# EAGLE design hd6303-exp-x1 (EAGLE 9.2.2)

## Sheet 1 of 2
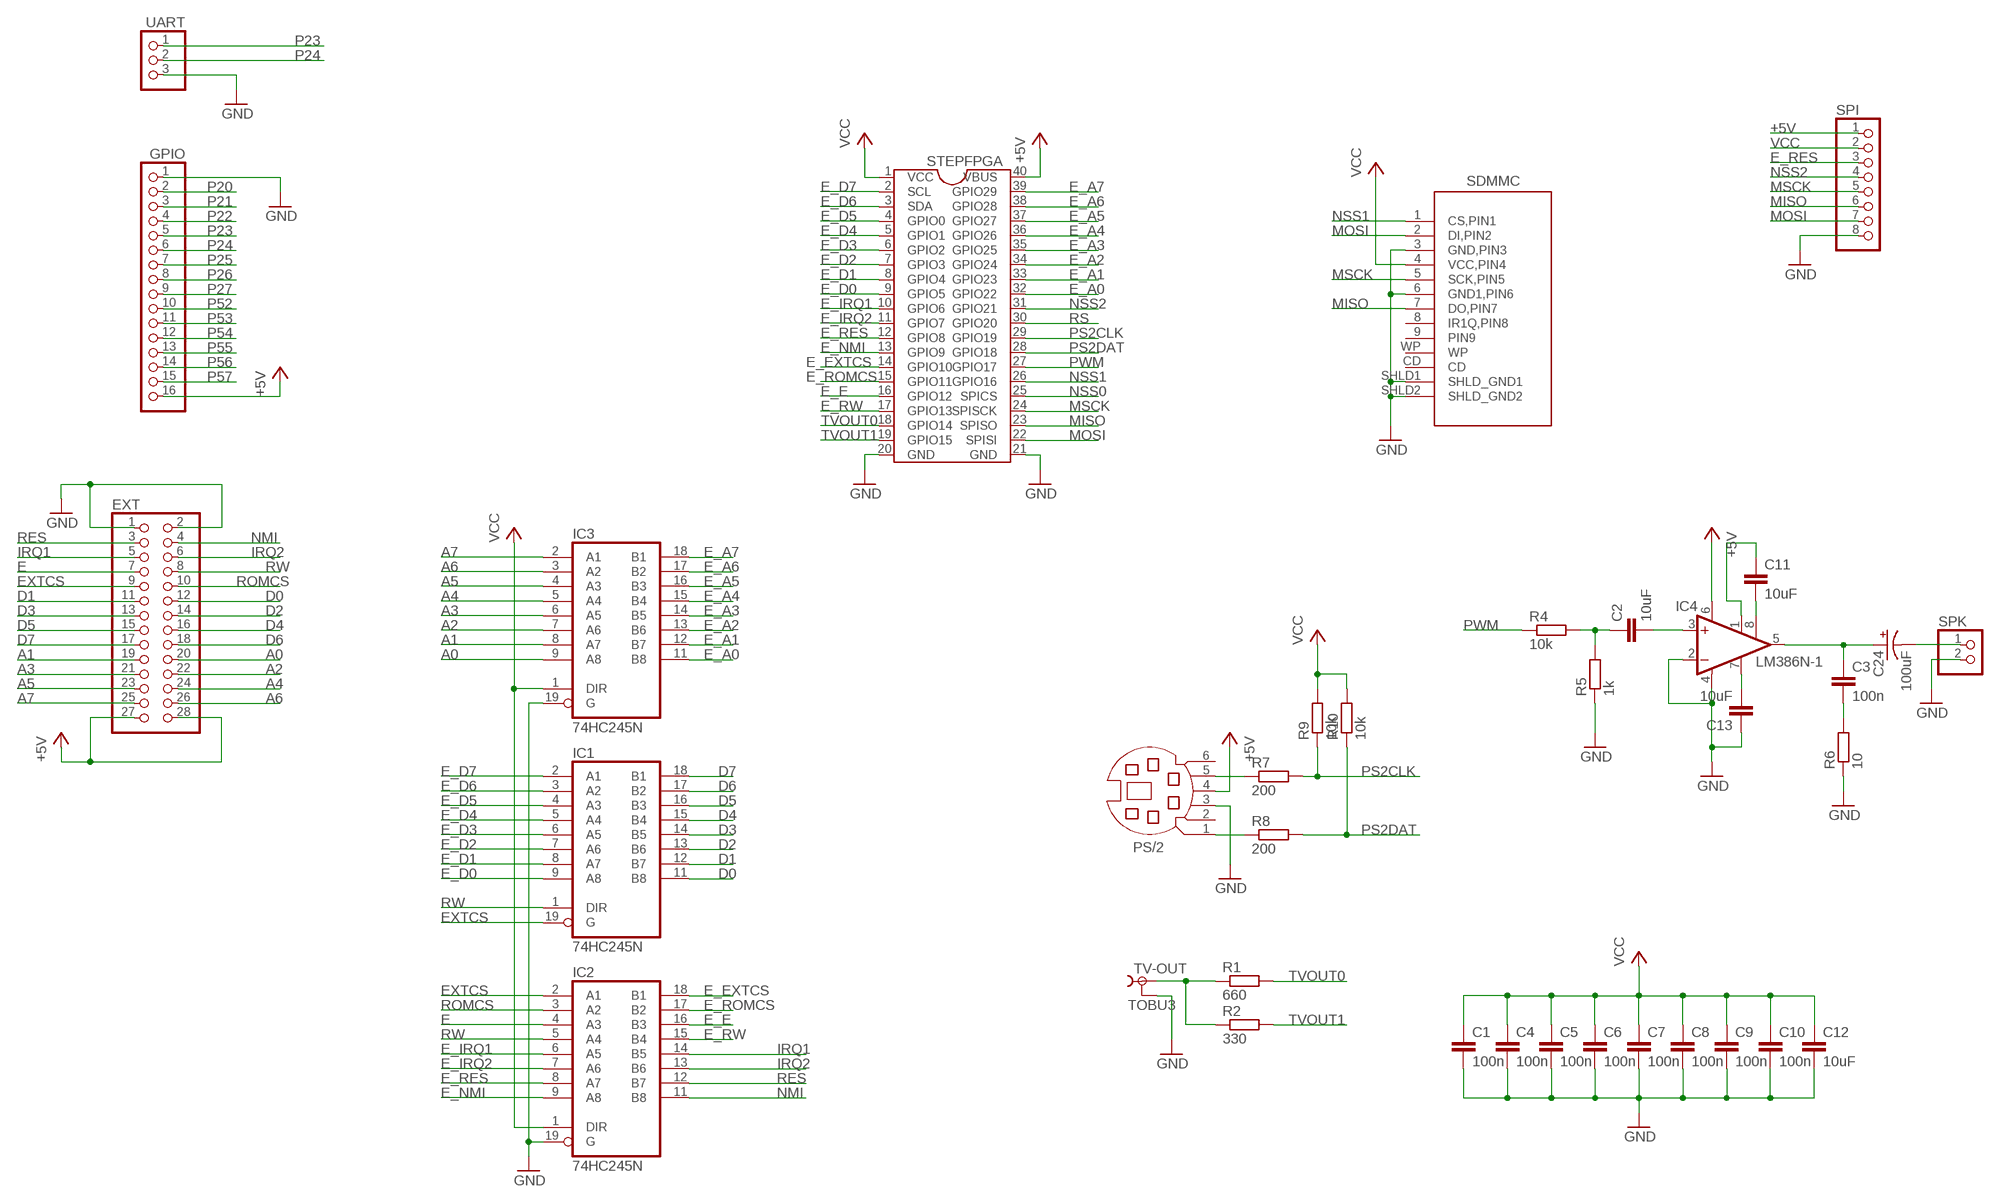
[diagram p0: schematic, sheet 1]

### Parts
C1  100n  C-EUC0603  [C0603]
C2  10uF  C-EUC0805  [C0805]
C3  100n  C-EUC0603  [C0603]
C4  100n  C-EUC0603  [C0603]
C5  100n  C-EUC0603  [C0603]
C6  100n  C-EUC0603  [C0603]
C7  100n  C-EUC0603  [C0603]
C8  100n  C-EUC0603  [C0603]
C9  100n  C-EUC0603  [C0603]
C10  100n  C-EUC0603  [C0603]
C11  10uF  C-EUC0805  [C0805]
C12  10uF  C-EUC0805  [C0805]
C13  10uF  C-EUC0805  [C0805]
C24  100uF  CAP_POL7343  [EIA7343]
EXT  PINHD-2X14  [2X14]
GPIO  PINHD-1X16  [1X16]
IC1  74HC245N  [DIL20]
IC2  74HC245N  [DIL20]
IC3  74HC245N  [DIL20]
IC4  LM386N-1  [DIL08]
PS/2  MD06SS  [MDIN06SS]
R1  660  R-EU_R0603  [R0603]
R2  330  R-EU_R0603  [R0603]
R4  10k  R-EU_R0603  [R0603]
R5  1k  R-EU_R0603  [R0603]
R6  10  R-EU_R0603  [R0603]
R7  200  R-EU_R0603  [R0603]
R8  200  R-EU_R0603  [R0603]
R9  10k  R-EU_R0603  [R0603]
R10  10k  R-EU_R0603  [R0603]
SDMMC  FCI_SD_SOCKET  [SD-MMC_SOCKET-PP]
SPI  PINHD-1X8  [1X08]
SPK  PINHD-1X2  [1X02]
STEPFPGA  STEPFPGA  [DIL40]
TV-OUT  TOBU3  [TOBU3]
UART  PINHD-1X3  [1X03]

### Nets
+5V: EXT.27 EXT.28 GPIO.16 IC4.6(VS) PS/2.4 SPI.1 STEPFPGA.40(VBUS)
A0: EXT.20 IC3.9(A8)
A1: EXT.19 IC3.8(A7)
A2: EXT.22 IC3.7(A6)
A3: EXT.21 IC3.6(A5)
A4: EXT.24 IC3.5(A4)
A5: EXT.23 IC3.4(A3)
A6: EXT.26 IC3.3(A2)
A7: EXT.25 IC3.2(A1)
D0: EXT.12 IC1.11(B8)
D1: EXT.11 IC1.12(B7)
D2: EXT.14 IC1.13(B6)
D3: EXT.13 IC1.14(B5)
D4: EXT.16 IC1.15(B4)
D5: EXT.15 IC1.16(B3)
D6: EXT.18 IC1.17(B2)
D7: EXT.17 IC1.18(B1)
E: EXT.7 IC2.4(A3)
E_A0: IC3.11(B8) STEPFPGA.32(GPIO22)
E_A1: IC3.12(B7) STEPFPGA.33(GPIO23)
E_A2: IC3.13(B6) STEPFPGA.34(GPIO24)
E_A3: IC3.14(B5) STEPFPGA.35(GPIO25)
E_A4: IC3.15(B4) STEPFPGA.36(GPIO26)
E_A5: IC3.16(B3) STEPFPGA.37(GPIO27)
E_A6: IC3.17(B2) STEPFPGA.38(GPIO28)
E_A7: IC3.18(B1) STEPFPGA.39(GPIO29)
E_D0: IC1.9(A8) STEPFPGA.9(GPIO5)
E_D1: IC1.8(A7) STEPFPGA.8(GPIO4)
E_D2: IC1.7(A6) STEPFPGA.7(GPIO3)
E_D3: IC1.6(A5) STEPFPGA.6(GPIO2)
E_D4: IC1.5(A4) STEPFPGA.5(GPIO1)
E_D5: IC1.4(A3) STEPFPGA.4(GPIO0)
E_D6: IC1.3(A2) STEPFPGA.3(SDA)
E_D7: IC1.2(A1) STEPFPGA.2(SCL)
E_E: IC2.16(B3) STEPFPGA.16(GPIO12)
E_EXTCS: IC2.18(B1) STEPFPGA.14(GPIO10)
E_IRQ1: IC2.6(A5) STEPFPGA.10(GPIO6)
E_IRQ2: IC2.7(A6) STEPFPGA.11(GPIO7)
E_NMI: IC2.9(A8) STEPFPGA.13(GPIO9)
E_RES: IC2.8(A7) SPI.3 STEPFPGA.12(GPIO8) ; also sheet 2
E_ROMCS: IC2.17(B2) STEPFPGA.15(GPIO11)
E_RW: IC2.15(B4) STEPFPGA.17(GPIO13)
EXTCS: EXT.9 IC1.19(G) IC2.2(A1)
GND: C1.2 C4.2 C5.2 C6.2 C7.2 C8.2 C9.2 C10.2 C12.2 C13.1 EXT.1 EXT.2 GPIO.1 IC2.19(G) IC3.19(G) IC4.2(-IN) IC4.4(GND) PS/2.3 R5.1 R6.1 SDMMC.3(GND,PIN3) SDMMC.6(GND1,PIN6) SDMMC.SHLD1(SHLD_GND1) SDMMC.SHLD2(SHLD_GND2) SPI.8 SPK.2 STEPFPGA.20(GND) STEPFPGA.21(GND) TV-OUT.2 TV-OUT.2@1 TV-OUT.2@2 UART.3 ; also sheet 2
IRQ1: EXT.5 IC2.14(B5)
IRQ2: EXT.6 IC2.13(B6)
MISO: SDMMC.7(DO,PIN7) SPI.6 STEPFPGA.23(SPISO)
MOSI: SDMMC.2(DI,PIN2) SPI.7 STEPFPGA.22(SPISI) ; also sheet 2
MSCK: SDMMC.5(SCK,PIN5) SPI.5 STEPFPGA.24(SPISCK) ; also sheet 2
N$4: C2.2 IC4.3(+IN)
N$5: C2.1 R4.2 R5.2
N$6: R1.1 R2.1 TV-OUT.1
N$7: C3.1 C24.A(+) IC4.5(OUT)
N$8: C3.2 R6.2
N$9: C11.1 IC4.1(GAIN)
N$10: C11.2 IC4.8(GAIN)
N$11: C24.C(-) SPK.1
N$12: C13.2 IC4.7(BYPASS)
N$23: PS/2.5 R7.1
N$24: PS/2.1 R8.1
NMI: EXT.4 IC2.11(B8)
NSS0: STEPFPGA.25(SPICS) ; also sheet 2
NSS1: SDMMC.1(CS,PIN1) STEPFPGA.26(GPIO16)
NSS2: SPI.4 STEPFPGA.31(GPIO21)
P20: GPIO.2
P21: GPIO.3
P22: GPIO.4
P23: GPIO.5 UART.1
P24: GPIO.6 UART.2
P25: GPIO.7
P26: GPIO.8
P27: GPIO.9
P52: GPIO.10
P53: GPIO.11
P54: GPIO.12
P55: GPIO.13
P56: GPIO.14
P57: GPIO.15
PS2CLK: R7.2 R9.1 STEPFPGA.29(GPIO19)
PS2DAT: R8.2 R10.1 STEPFPGA.28(GPIO18)
PWM: R4.1 STEPFPGA.27(GPIO17)
RES: EXT.3 IC2.12(B7)
ROMCS: EXT.10 IC2.3(A2)
RS: STEPFPGA.30(GPIO20) ; also sheet 2
RW: EXT.8 IC1.1(DIR) IC2.5(A4)
TVOUT0: R1.2 STEPFPGA.18(GPIO14)
TVOUT1: R2.2 STEPFPGA.19(GPIO15)
VCC: C1.1 C4.1 C5.1 C6.1 C7.1 C8.1 C9.1 C10.1 C12.1 IC2.1(DIR) IC3.1(DIR) R9.2 R10.2 SDMMC.4(VCC,PIN4) SPI.2 STEPFPGA.1(VCC) ; also sheet 2
Unconnected: PS/2.2 PS/2.6 SDMMC.8(IR1Q,PIN8) SDMMC.9(PIN9) SDMMC.CD SDMMC.WP

## Sheet 2 of 2
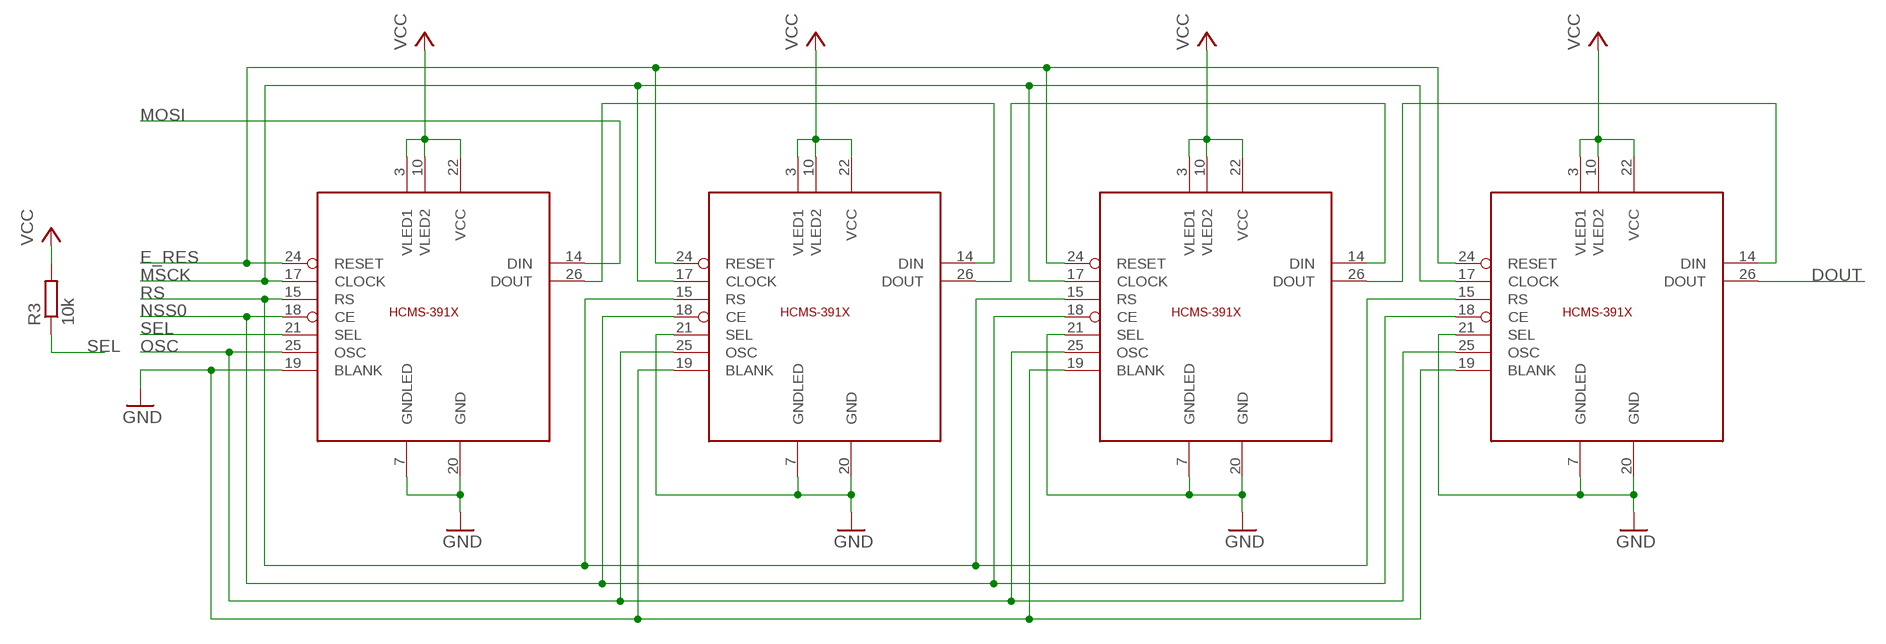
[diagram p1: schematic, sheet 2]

### Parts
R3  10k  R-EU_R0603  [R0603]
U$1  HCMS-391X  [HCMS-391X]
U$2  HCMS-391X  [HCMS-391X]
U$3  HCMS-391X  [HCMS-391X]
U$4  HCMS-391X  [HCMS-391X]

### Nets
DOUT: U$4.26(DOUT)
E_RES: U$1.24(RESET) U$2.24(RESET) U$3.24(RESET) U$4.24(RESET) ; also sheet 1
GND: U$1.7(GNDLED) U$1.19(BLANK) U$1.20(GND) U$2.7(GNDLED) U$2.19(BLANK) U$2.20(GND) U$2.21(SEL) U$3.7(GNDLED) U$3.19(BLANK) U$3.20(GND) U$3.21(SEL) U$4.7(GNDLED) U$4.19(BLANK) U$4.20(GND) U$4.21(SEL) ; also sheet 1
MOSI: U$1.14(DIN) ; also sheet 1
MSCK: U$1.17(CLOCK) U$2.17(CLOCK) U$3.17(CLOCK) U$4.17(CLOCK) ; also sheet 1
N$1: U$1.26(DOUT) U$2.14(DIN)
N$2: U$2.26(DOUT) U$3.14(DIN)
N$3: U$3.26(DOUT) U$4.14(DIN)
NSS0: U$1.18(CE) U$2.18(CE) U$3.18(CE) U$4.18(CE) ; also sheet 1
OSC: U$1.25(OSC) U$2.25(OSC) U$3.25(OSC) U$4.25(OSC)
RS: U$1.15(RS) U$2.15(RS) U$3.15(RS) U$4.15(RS) ; also sheet 1
SEL: R3.1 U$1.21(SEL)
VCC: R3.2 U$1.3(VLED1) U$1.10(VLED2) U$1.22(VCC) U$2.3(VLED1) U$2.10(VLED2) U$2.22(VCC) U$3.3(VLED1) U$3.10(VLED2) U$3.22(VCC) U$4.3(VLED1) U$4.10(VLED2) U$4.22(VCC) ; also sheet 1

## Power pins joined to a net without a drawn wire
GND: IC1.10(GND) IC2.10(GND) IC3.10(GND)
VCC: IC1.20(VCC) IC2.20(VCC) IC3.20(VCC)

## Library data of the parts
C1 C3-C10 = rcl:C-EU: CAPACITOR, European symbol
C2 C11-C13 = resistor:C-EU: CAPACITOR, European symbol
C24 = SparkFun:CAP_POL: Capacitor Polarized These are standard SMD and PTH capacitors. Normally 10uF, 47uF, and 100uF in electrolytic and tantalum varieties. Always verify the external diameter of the through hole cap, it varies with capacity, voltage, and manufacturer. The EIA devices should be standard.
EXT = pinhead:PINHD-2X14: PIN HEADER
GPIO = pinhead:PINHD-1X16: PIN HEADER
IC1-IC3 = 74xx-eu:74*245: Octal BUS TRANSCEIVER, 3-state
IC4 = linear:LM386?-*: Low Voltage Audio Power Amplifier Source: http://cache.national.com/ds/LM/LM386.pdf
PS/2 = con-yamaichi:MD06SS: YAMAICHI CONNECTOR; OC_FARNELL: unknown; OC_NEWARK: unknown
R1-R10 = resistor:R-EU_: RESISTOR, European symbol
SDMMC = stepfpga:FCI_SD_SOCKET: FCI Memory Card Connector (SD card); MF: FCI; MOUSER: 649-10067847-001RLF; MPN: 10067847-001RLF
SPI = pinhead:PINHD-1X8: PIN HEADER
SPK = pinhead:PINHD-1X2: PIN HEADER
STEPFPGA = stepfpga:STEPFPGA: StepFPGA module
TV-OUT = con-hirschmann:TOBU3: Female Cinch CONNECTOR ( RCA Jack ); MF: FARNELL; MPN: TOBU 3; OC_FARNELL: 592791; OC_NEWARK: 06WX5914
U$1-U$4 = HCMS-391X:HCMS-391X
UART = pinhead:PINHD-1X3: PIN HEADER

## Board
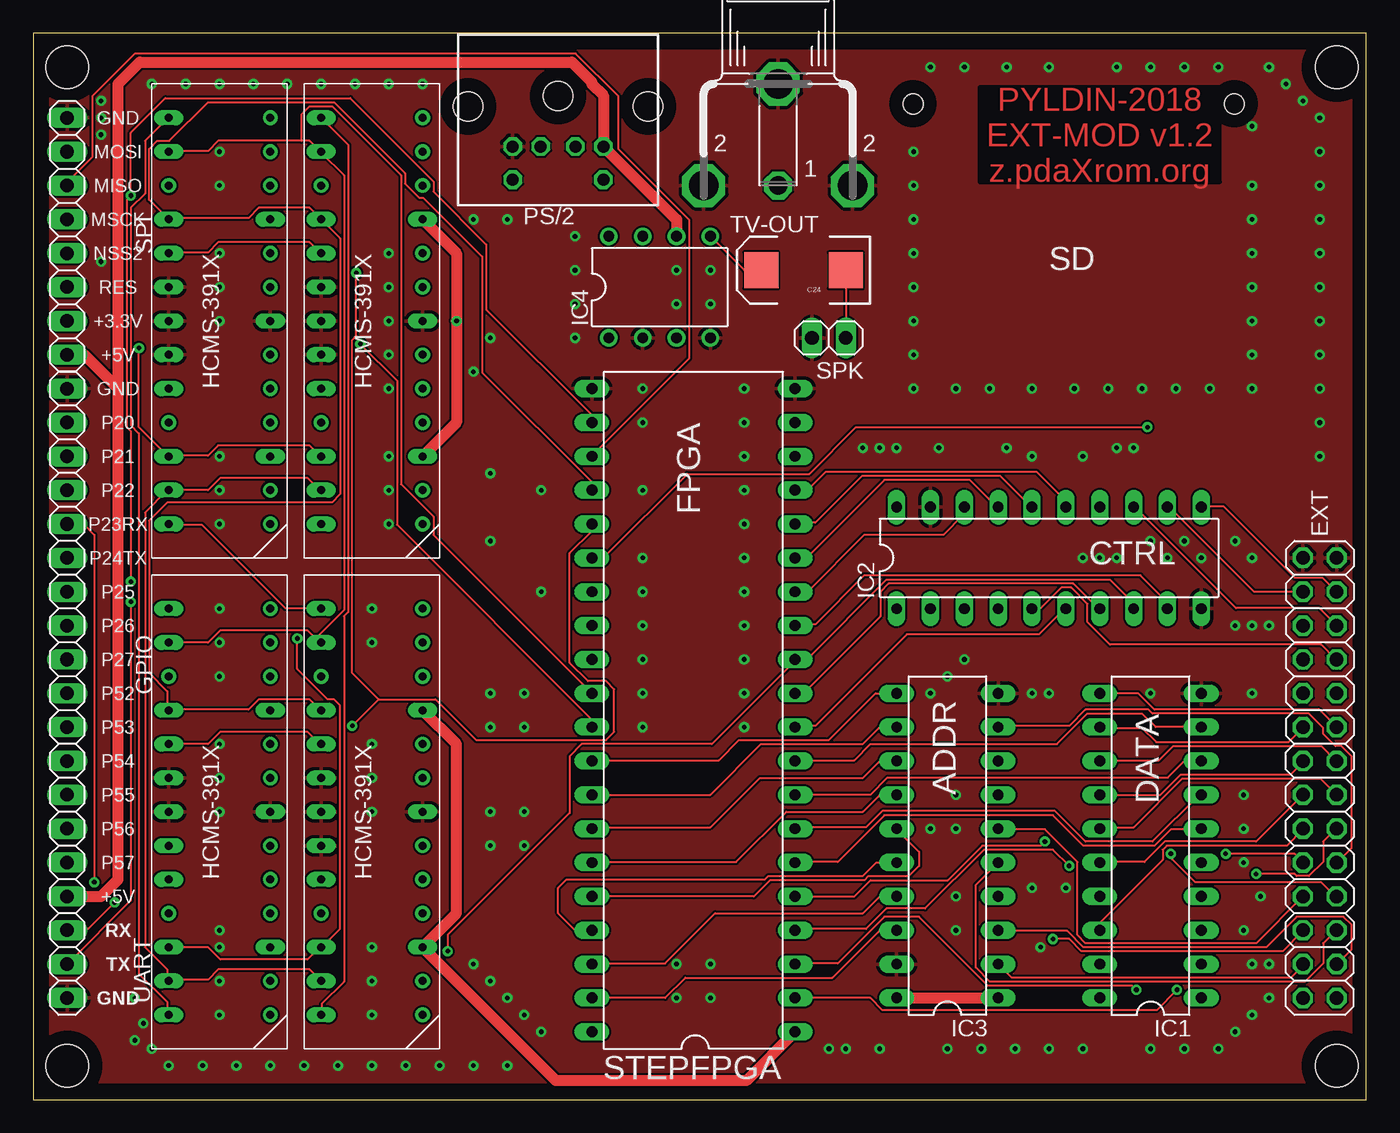
[diagram p2: board, top side]
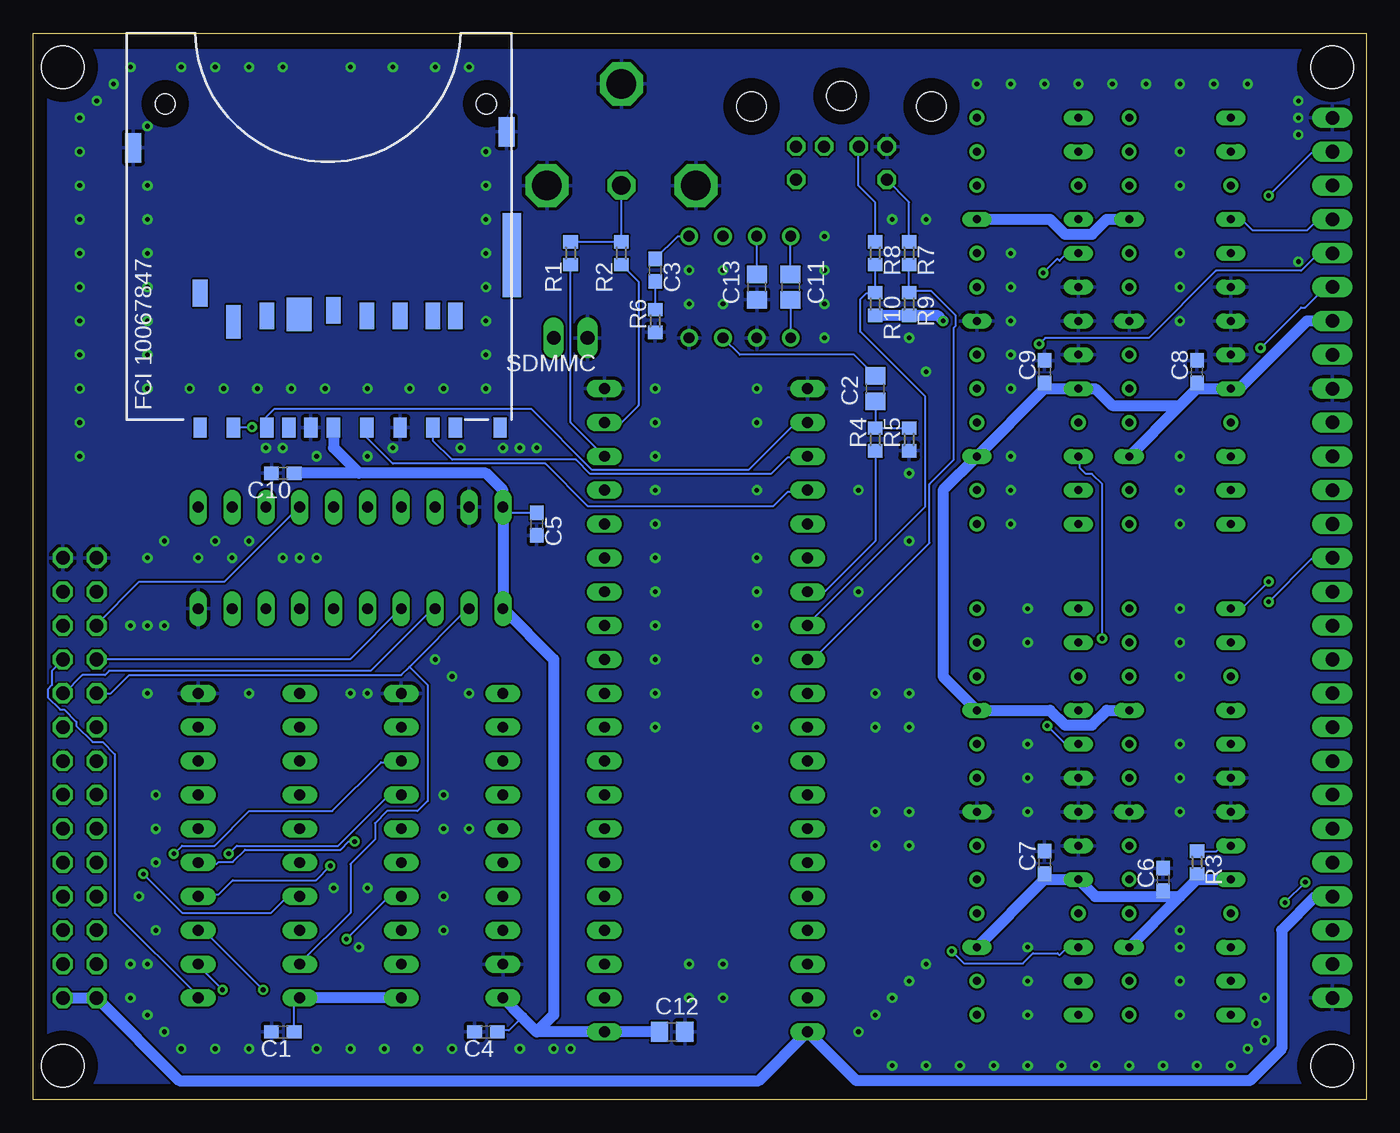
[diagram p3: board, bottom side, seen from below]

Size 100 x 80 mm. Coordinates in mm from the lower left corner, seen from the top.
Outline: 0,0 100,0 100,80 0,80 0,0
Copper layers (1*16): Top 0.035mm / dielectric 1.5mm / Bottom 0.035mm
Design rules "default *": minimum track width 6mil, minimum drill 0.35mm, track to track 6mil, track to pad 6mil, pad to pad 6mil, via to via 6mil, smd to smd 6mil, copper to edge 40mil, drill to drill 6mil, minimum pad ring 10mil, minimum via ring 8mil, stop-mask expansion 4mil, vias tented up to drill 23mil, thermal gap 10mil
Holes 3.2 mm at 2.54,77.47 2.54,2.54 97.79,2.54 97.79,77.47

### Footprints (pad centres in the part's own frame; a part is rotated, then mirrored left to right if it is on the bottom)
C0603 = smd 1.1 x 1: 1 -0.85,0; 2 0.85,0
C0805 = smd 1.3 x 1.5: 1 -0.95,0; 2 0.95,0
EIA7343 = smd 2.55 x 2.7: A 3.17,0; C -3.17,0
2X14 = drill 1.016 octagon: 1 -16.51,-1.27; 2 -16.51,1.27; 3 -13.97,-1.27; 4 -13.97,1.27; 5 -11.43,-1.27; 6 -11.43,1.27; 7 -8.89,-1.27; 8 -8.89,1.27; 9 -6.35,-1.27; 10 -6.35,1.27; 11 -3.81,-1.27; 12 -3.81,1.27; 13 -1.27,-1.27; 14 -1.27,1.27; 15 1.27,-1.27; 16 1.27,1.27; 17 3.81,-1.27; 18 3.81,1.27; 19 6.35,-1.27; 20 6.35,1.27; 21 8.89,-1.27; 22 8.89,1.27; 23 11.43,-1.27; 24 11.43,1.27; 25 13.97,-1.27; 26 13.97,1.27; 27 16.51,-1.27; 28 16.51,1.27
1X16 = drill 1.016 long: 1 -19.05,0; 2 -16.51,0; 3 -13.97,0; 4 -11.43,0; 5 -8.89,0; 6 -6.35,0; 7 -3.81,0; 8 -1.27,0; 9 1.27,0; 10 3.81,0; 11 6.35,0; 12 8.89,0; 13 11.43,0; 14 13.97,0; 15 16.51,0; 16 19.05,0
DIL20 = drill 0.813 long: 1 -11.43,-3.81; 2 -8.89,-3.81; 3 -6.35,-3.81; 4 -3.81,-3.81; 5 -1.27,-3.81; 6 1.27,-3.81; 7 3.81,-3.81; 8 6.35,-3.81; 9 8.89,-3.81; 10 11.43,-3.81; 11 11.43,3.81; 12 8.89,3.81; 13 6.35,3.81; 14 3.81,3.81; 15 1.27,3.81; 16 -1.27,3.81; 17 -3.81,3.81; 18 -6.35,3.81; 19 -8.89,3.81; 20 -11.43,3.81
DIL08 = drill 0.813 pad 1.27: 1 -3.81,-3.81; 2 -1.27,-3.81; 3 1.27,-3.81; 4 3.81,-3.81; 5 3.81,3.81; 6 1.27,3.81; 7 -1.27,3.81; 8 -3.81,3.81
MDIN06SS = drill 0.9 octagon: 1 1.3,8.5; 2 -1.3,8.5; 3 3.4,8.5; 4 -3.4,8.5; 5 3.4,11; 6 -3.4,11 | hole 2.2: -6.75,5.5; 0,4.7; 6.75,5.5
R0603 = smd 1 x 1.1: 1 -0.85,0; 2 0.85,0
SD-MMC_SOCKET-PP = smd 1 x 1.5: 1 6.875,29.6; 2 4.375,29.6; 3 1.075,29.6; 4 -0.625,29.6; 5 -3.125,29.6; 6 -5.625,29.6; 7 -8.075,29.6; 8 -9.775,29.6; 9 9.375,29.6; CD 2.725,29.6; WP -13.125,29.6 | smd 1.4 x 6.3: 14 -14,16.65 | smd 1.2 x 2.2: SHLD1 -13.6,7.4; SHLD2 14.4,8.6 | smd 1.1 x 2: SW -9.775,21.2; SW1 -8.075,21.2; SW2 -5.625,21.2; SW3 -3.125,21.2; SW4 -0.625,20.8; SW6 4.375,21.2; SW8 9.375,19.5 | smd 1.9 x 2.5: SW5 1.95,21.1 | smd 1.1 x 2.5: SW7 6.875,21.65 | hole 1.5: -12.1,5.3; 12,5.3
1X08 = drill 1.016 long: 1 -8.89,0; 2 -6.35,0; 3 -3.81,0; 4 -1.27,0; 5 1.27,0; 6 3.81,0; 7 6.35,0; 8 8.89,0
1X02 = drill 1.016 long: 1 -1.27,0; 2 1.27,0
DIL40 = drill 0.813 long: 1 -24.13,-7.62; 2 -21.59,-7.62; 3 -19.05,-7.62; 4 -16.51,-7.62; 5 -13.97,-7.62; 6 -11.43,-7.62; 7 -8.89,-7.62; 8 -6.35,-7.62; 9 -3.81,-7.62; 10 -1.27,-7.62; 11 1.27,-7.62; 12 3.81,-7.62; 13 6.35,-7.62; 14 8.89,-7.62; 15 11.43,-7.62; 16 13.97,-7.62; 17 16.51,-7.62; 18 19.05,-7.62; 19 21.59,-7.62; 20 24.13,-7.62; 21 24.13,7.62; 22 21.59,7.62; 23 19.05,7.62; 24 16.51,7.62; 25 13.97,7.62; 26 11.43,7.62; 27 8.89,7.62; 28 6.35,7.62; 29 3.81,7.62; 30 1.27,7.62; 31 -1.27,7.62; 32 -3.81,7.62; 33 -6.35,7.62; 34 -8.89,7.62; 35 -11.43,7.62; 36 -13.97,7.62; 37 -16.51,7.62; 38 -19.05,7.62; 39 -21.59,7.62; 40 -24.13,7.62
TOBU3 = drill 1.397 octagon: 1 0,-2.54 | drill 2.21 octagon: 2 5.588,-2.54; 2@1 -5.588,-2.54; 2@2 0,5.08
HCMS-391X = drill 0.6 long: 3 -10.16,-3.81; 7 0,-3.81; 10 7.62,-3.81; 14 15.24,3.81; 15 12.7,3.81; 17 7.62,3.81; 18 5.08,3.81; 19 2.54,3.81; 20 0,3.81; 21 -2.54,3.81; 22 -5.08,3.81; 24 -10.16,3.81; 25 -12.7,3.81; 26 -15.24,3.81 | drill 0.6: P$1 -15.24,-3.81; P$2 -12.7,-3.81; P$3 -7.62,3.81; P$4 -7.62,-3.81; P$5 -5.08,-3.81; P$6 -2.54,-3.81; P$7 2.54,-3.81; P$8 5.08,-3.81; P$9 10.16,-3.81; P$10 12.7,-3.81; P$11 15.24,-3.81; P$12 10.16,3.81
1X03 = drill 1.016 long: 1 -2.54,0; 2 0,0; 3 2.54,0

### Placement (x,y rotation side)
C1  81.28,5.08 180 bottom
C2  36.83,53.34 90 bottom
C3  53.34,62.23 270 bottom
C4  66.04,5.08 180 bottom
C5  62.23,43.18 270 bottom
C6  15.24,16.51 90 bottom
C7  24.13,17.78 90 bottom
C8  12.7,54.61 90 bottom
C9  24.13,54.61 90 bottom
C10  81.28,46.99 180 bottom
C11  43.18,60.96 90 bottom
C12  52.07,5.08 0 bottom
C13  45.72,60.96 90 bottom
C24  57.78,62.23 180 top
EXT  96.52,24.13 270 top
GPIO  2.54,34.29 270 top
IC1  83.82,19.05 90 top
IC2  76.2,40.64 0 top
IC3  68.58,19.05 90 top
IC4  46.99,60.96 0 top
PS/2  39.37,80.01 180 top
R1  59.69,63.5 270 bottom
R2  55.88,63.5 270 bottom
R3  12.7,17.78 270 bottom
R4  36.83,49.53 90 bottom
R5  34.29,49.53 90 bottom
R6  53.34,58.42 90 bottom
R7  34.29,63.5 270 bottom
R8  36.83,63.5 270 bottom
R9  34.29,59.69 270 bottom
R10  36.83,59.69 270 bottom
SDMMC  78.11,80.01 180 bottom
SPI  2.54,64.77 90 top
SPK  59.69,57.15 180 top
STEPFPGA  49.53,29.21 90 top
TV-OUT  55.88,71.12 0 top
U$1  13.97,21.59 90 top
U$2  13.97,58.42 90 top
U$3  25.4,21.59 90 top
U$4  25.4,58.42 90 top
UART  2.54,10.16 270 top

### Tracks (layer width: path | path; a pad name or v marks a point on that pad's centre or on a via)
+5V
  Top 0.813: GPIO.16 5.08,15.24 6.35,16.51 6.35,53.34 | 6.35,53.34 6.35,76.2 7.98,77.83 40.41,77.83 41.89,76.36 41.89,76.22 42.77,75.34 PS/2.4 48.26,66.02 IC4.6 | 6.35,53.34 3.81,55.88 SPI.1
  Bottom 0.813: EXT.28 EXT.27 89.05,1.42 45.57,1.42 STEPFPGA.40 38.25,1.42 8.74,1.42 6.35,3.81 6.35,12.7 3.81,15.24 GPIO.16
A0
  Top 0.152: EXT.20 98.91,18.9 98.91,25.76 98.15,26.52 97.69,26.52 96.77,27.43 96.77,27.89 95.71,28.96 83.97,28.96 83.67,29.26 78.94,29.26 77.72,28.04 72.39,28.04 IC3.9
A1  (via drill 0.35)
  Top 0.152: v89.46,18.44 94.64,18.44 95.25,17.83 EXT.19
  Bottom 0.152: v89.46,18.44 88.85,19.05 86.41,19.05 83.82,21.64 77.57,21.64 73.91,25.3 72.39,25.3 IC3.8
A2  (via drill 0.35)
  Top 0.152: v85.34,18.44 85.34,18.14 87.17,16.31 96.62,16.31 97.69,15.24 EXT.22
  Bottom 0.152: IC3.7 73.3,22.86 77.11,19.05 84.73,19.05 v85.34,18.44
A3
  Top 0.152: EXT.21 91.75,11.73 78.94,11.73 78.33,12.34 78.33,17.83 75.89,20.27 72.39,20.27 IC3.6
A4
  Top 0.152: EXT.24 97.69,12.65 96.77,11.73 96.77,10.21 95.4,8.84 71.78,8.84 70.71,9.91 70.71,16.1 IC3.5
A5  (via drill 0.35)
  Top 0.152: v76.5,12.04 77.72,12.04 78.64,11.12 93.73,11.12 95.25,12.65 EXT.23
  Bottom 0.152: IC3.4 73.3,15.24 v76.5,12.04
A6
  Top 0.152: EXT.26 98.91,11.28 98.91,13.11 98.3,13.72 94.79,13.72 92.51,11.43 78.79,11.43 77.57,12.65 72.39,12.65 IC3.3
A7
  Top 0.152: EXT.25 95.25,10.06 94.34,9.14 73.41,9.14 IC3.2
D0
  Top 0.152: IC1.11 82.91,30.48 84.12,29.26 96.47,29.26 EXT.12
D1
  Top 0.152: IC1.12 80.01,27.89 83.19,27.89 84.25,26.82 94.18,26.82 95.25,27.89 EXT.11
D2
  Top 0.152: IC1.13 80.01,25.45 84.45,25.45 85.52,26.52 96.62,26.52 97.69,25.45 EXT.14
D3
  Top 0.152: EXT.13 95.25,25.3 94.34,24.38 86.08,24.38 84.56,22.86 IC1.14
D4
  Top 0.152: IC1.15 80.01,20.42 82.55,20.42 86.21,24.08 96.57,24.08 EXT.16
D5
  Top 0.152: EXT.15 91.75,19.36 84.89,19.36 83.36,17.83 80.01,17.83 IC1.16
D6  (via drill 0.35)
  Top 0.152: v91.75,16.92 94.64,16.92 94.79,16.76 95.71,16.76 96.77,17.83 96.77,19.36 97.69,20.27 EXT.18
  Bottom 0.152: IC1.17 80.92,15.24 82.14,14.02 88.85,14.02 v91.75,16.92
D7
  Top 0.152: IC1.18 80.01,13.26 84.73,17.98 84.73,18.75 85.04,19.05 94.03,19.05 95.25,20.27 EXT.17
E
  Bottom 0.152: EXT.7 95.25,33.07 76.2,33.07 72.44,36.83 IC2.4
E_A0
  Top 0.152: STEPFPGA.32 41.91,25.45 51.44,25.45 52.96,26.98 59.69,26.98 63.2,30.48 IC3.11
E_A1
  Top 0.152: STEPFPGA.33 50.8,22.86 54.61,26.67 62.23,26.67 63.5,27.94 IC3.12
E_A2
  Top 0.152: STEPFPGA.34 41.91,20.42 50.8,20.42 54.51,24.13 62.23,24.13 63.5,25.4 IC3.13
E_A3
  Top 0.152: STEPFPGA.35 41.91,17.83 52.73,17.83 56.49,21.59 62.23,21.59 63.5,22.86 IC3.14
E_A4
  Top 0.152: IC3.15 64.77,20.27 66.45,18.59 66.45,17.53 65.68,16.76 62.66,16.76 62.36,16.46 55.27,16.46 54.05,15.24 STEPFPGA.36
E_A5
  Top 0.152: IC3.16 63.25,17.78 62.23,16.76 55.14,16.76 54.89,16.51 40.01,16.51 39.37,15.88 39.37,13.97 40.64,12.7 STEPFPGA.37
E_A6
  Top 0.152: STEPFPGA.38 41.91,10.21 47.4,10.21 51.16,13.97 62.23,13.97 63.5,15.24 IC3.17
E_A7
  Top 0.152: STEPFPGA.39 47.4,7.62 48.92,9.14 59.94,9.14 63.5,12.7 IC3.18
E_D0
  Top 0.152: STEPFPGA.9 57.15,25.45 61.59,25.45 62.81,26.67 76.81,26.67 79.1,28.96 83.19,28.96 84.2,27.94 IC1.9
E_D1
  Top 0.152: STEPFPGA.8 62.79,22.86 64.1,24.17 85.13,24.17 86.36,25.4 IC1.8
E_D2
  Top 0.152: IC1.7 87.48,22.86 83.97,19.36 78.94,19.36 76.66,21.64 63.7,21.64 62.48,20.42 57.15,20.42 STEPFPGA.7
E_D3
  Top 0.152: STEPFPGA.6 57.15,17.83 60.35,17.83 63.86,21.34 76.5,21.34 78.79,19.05 84.12,19.05 85.34,20.27 87.63,20.27 IC1.6
E_D4  (via drill 0.35)
  Top 0.152: STEPFPGA.5 61.59,15.24 62.81,16.46 68.61,16.46 71.2,19.05 75.59,19.05 v75.89,19.36
  Bottom 0.152: v75.89,19.36 76.35,19.36 76.96,18.75 84.12,18.75 85.04,17.83 86.11,17.83 86.26,17.68 87.63,17.68 IC1.5
E_D5  (via drill 0.35)
  Top 0.152: v77.72,17.53 76.5,18.75 71.32,18.75 66.9,14.33 64.01,14.33 62.48,12.8 57.15,12.8 STEPFPGA.4
  Bottom 0.152: v77.72,17.53 78.79,16.46 85.04,16.46 86.11,15.39 87.48,15.39 IC1.4
E_D6  (via drill 0.35)
  Top 0.152: v82.75,8.23 82.45,8.53 71.63,8.53 66.45,13.72 63.86,13.72 60.35,10.21 57.15,10.21 STEPFPGA.3
  Bottom 0.152: v82.75,8.23 87.17,12.65 87.63,12.65 IC1.3
E_D7  (via drill 0.35)
  Top 0.152: STEPFPGA.2 62.79,7.62 63.7,6.71 84.28,6.71 v85.8,8.23
  Bottom 0.152: v85.8,8.23 87.63,10.06 IC1.2
E_E
  Top 0.152: STEPFPGA.16 57.15,43.28 58.67,43.28 62.18,46.79 72.54,46.79 74.83,44.5 IC2.16
E_EXTCS
  Top 0.152: STEPFPGA.14 58.06,38.1 62.33,42.37 68.28,42.37 69.8,43.89 69.8,44.35 IC2.18
E_IRQ1
  Top 0.152: STEPFPGA.10 57.15,28.04 58.67,28.04 65.53,34.9 75.44,34.9 77.42,36.88 IC2.6
E_IRQ2
  Top 0.152: IC2.7 80.01,36.73 78.03,38.71 64.16,38.71 63.55,38.1 63.55,36.25 57.78,30.48 STEPFPGA.11
E_NMI
  Top 0.152: STEPFPGA.13 57.15,35.66 58.67,35.66 62.33,39.32 83.06,39.32 85.04,37.34 85.04,36.88 IC2.9
E_RES  (via drill 0.35)
  Top 0.152: IC2.8 82.45,36.88 82.45,37.34 80.77,39.01 64.01,39.01 58.06,33.07 57.15,33.07 STEPFPGA.12 57.15,32.92 50.9,26.67 41.15,26.67 40.23,25.76 40.23,21.49 31.09,12.34 v31.09,11.12 | U$4.24 21.49,48.31 20.73,49.07 13.87,49.07 13.11,48.31 10.21,48.31 U$2.24 10.06,48.31 7.92,50.44 v7.92,56.39 | U$1.24 13.11,11.43 14.02,10.52 20.57,10.52 21.49,11.43 U$3.24 21.64,11.43 23.01,12.8 23.01,29.57 22.55,30.02 22.1,30.02 19.81,32.31 v19.81,34.59
  Bottom 0.152: SPI.3 3.05,60.96 4.57,59.44 4.88,59.44 v7.92,56.39 | U$3.24 22.4,11.43 23.01,10.82 23.16,10.97 24.99,10.97 25.76,10.21 30.18,10.21 v31.09,11.12 | v19.81,34.59 19.81,46.18 20.57,46.94 21.03,46.94 21.49,47.4 21.49,48.16 U$4.24
E_ROMCS
  Top 0.152: STEPFPGA.15 57.15,40.69 58.06,40.69 63.86,46.48 70.26,46.48 72.39,44.35 IC2.17
E_RW
  Top 0.152: STEPFPGA.17 58.06,45.72 59.44,47.09 75.29,47.09 77.42,44.96 77.42,44.5 IC2.15
EXTCS
  Bottom 0.152: EXT.9 94.18,30.48 92.81,31.85 72.39,31.85 71.78,32.46 | IC2.2 67.41,36.83 71.78,32.46 | 71.78,32.46 70.41,31.09 70.41,22.4 71.17,21.64 73.46,21.64 74.37,20.73 74.37,19.51 76.2,17.68 76.2,14.02 80.01,10.21 IC1.19
GND  (via drill 0.35)
  other vias: 74.93,48.26 78.74,48.26 81.28,48.9 82.55,48.9 62.23,48.9 63.5,48.9 64.77,48.9 67.94,48.9 73.03,48.9 78.74,40.64 80.01,40.64 81.28,40.64 83.82,41.91 85.09,40.64 86.36,41.91 87.63,40.64 90.17,41.91 91.44,40.64 90.17,35.56 91.44,35.56 92.71,35.56 91.44,30.48 83.82,30.48 67.31,30.48 68.58,31.75 69.85,33.02 74.93,30.48 76.2,30.48 45.72,53.34 53.34,53.34 53.34,50.8 53.34,48.26 45.72,50.8 45.72,45.72 45.72,40.64 45.72,38.1 45.72,35.56 45.72,33.02 45.72,30.48 45.72,27.94 53.34,27.94 53.34,30.48 53.34,33.02 53.34,35.56 53.34,38.1 53.34,40.64 53.34,43.18 53.34,45.72 40.64,64.77 40.64,62.23 40.64,59.69 40.64,57.15 48.26,59.69 48.26,62.23 50.8,62.23 50.8,59.69 66.04,71.12 66.04,68.58 66.04,66.04 66.04,63.5 66.04,60.96 66.04,58.42 66.04,55.88 66.04,53.34 69.22,53.34 71.75,53.34 74.93,53.34 78.11,53.34 80.64,53.34 83.19,53.34 85.72,53.34 88.27,53.34 91.44,53.34 91.44,55.88 91.44,58.42 91.44,60.96 91.44,63.5 91.44,66.04 91.44,73.03 91.44,68.58 88.9,77.47 86.36,77.47 83.82,77.47 81.28,77.47 76.2,77.47 73.03,77.47 69.85,77.47 67.31,77.47 7.62,7.62 8.26,5.71 7.62,4.45 8.89,3.81 10.16,2.54 12.7,2.54 15.24,2.54 17.78,2.54 20.32,2.54 22.86,2.54 25.4,2.54 27.94,2.54 30.48,2.54 33.02,2.54 35.56,2.54 5.08,74.93 8.89,76.2 11.43,76.2 13.97,76.2 16.51,76.2 21.59,76.2 24.13,76.2 26.67,76.2 29.21,76.2 13.97,71.12 13.97,68.58 26.67,63.5 13.97,63.5 13.97,60.96 13.97,48.26 13.97,45.72 13.97,43.18 26.67,43.18 26.67,45.72 26.67,48.26 26.67,53.34 26.67,55.88 26.67,58.42 26.67,60.96 19.05,76.2 13.97,58.42 13.97,36.83 25.4,36.83 25.4,34.29 13.97,34.29 13.97,31.75 25.4,26.67 25.4,24.13 25.4,21.59 13.97,26.67 13.97,24.13 13.97,21.59 13.97,12.7 13.97,11.43 13.97,8.89 13.97,6.35 25.4,6.35 25.4,8.89 25.4,11.43 33.02,10.16 34.29,8.89 35.56,7.62 36.83,6.35 38.1,5.08 59.69,3.81 60.96,3.81 63.5,3.81 68.58,3.81 71.12,3.81 73.66,3.81 76.2,3.81 78.74,3.81 83.82,3.81 86.36,3.81 88.9,3.81 90.17,5.08 91.44,6.35 92.71,7.62 48.26,10.16 50.8,10.16 50.8,7.62 48.26,7.62 36.83,21.59 36.83,19.05 34.29,19.05 34.29,21.59 34.29,30.48 36.83,30.48 36.83,27.94 34.29,27.94 96.52,71.12 96.52,68.58 96.52,66.04 96.52,63.5 96.52,60.96 96.52,58.42 96.52,55.88 96.52,53.34 96.52,50.8 96.52,48.26 92.71,77.47 93.98,76.2 95.25,74.93 96.52,73.66 33.02,66.04 35.56,66.04 34.29,57.15 33.02,54.61 34.29,46.99 38.1,45.72 34.29,41.91 38.1,38.1 5.08,62.87 74.93,15.88 75.56,11.43 67.31,20.32 69.22,20.32 69.22,15.24 69.22,12.7 69.22,22.86 90.81,22.86 90.81,20.32 90.81,17.78 92.08,15.24 90.81,12.7 91.44,10.16 92.71,10.16 77.47,15.88 5.08,73.66 5.08,72.39
  pour Top: 1.27,78.74 99.06,78.74 99.06,1.27 1.27,1.27
  pour Bottom: 1.27,78.74 99.06,78.74 99.06,1.27 1.27,1.27
IRQ1
  Bottom 0.152: EXT.5 95.25,35.66 92.05,38.86 85.65,38.86 80.06,44.45 IC2.14
IRQ2
  Top 0.152: EXT.6 96.47,36.88 90.22,36.88 82.65,44.45 IC2.13
MISO
  Top 0.152: SPI.6 2.59,68.58 2.59,68.89 4.42,70.71 4.42,75.29 7.62,78.49 40.69,78.49 43.89,75.29 43.89,71.32 49.23,65.99 49.23,55.63 41.91,48.31 STEPFPGA.23
  Bottom 0.152: 70.03,50.29 SDMMC.7 70.03,49.46 68.58,48.01 59.28,48.01 58.22,46.94 44.65,46.94 43.43,48.16 41.91,48.16 STEPFPGA.23
MOSI  (via drill 0.35)
  Top 0.152: v7.32,38.86 7.32,50.14 7.01,50.44 7.01,67.51 v7.32,67.82 7.32,72.54 9.91,75.13 23.77,75.13 30.02,68.89 30.02,68.12 33.98,64.16 33.98,59.28 41.91,51.36 STEPFPGA.22
  Bottom 0.152: 82.37,50.44 SDMMC.2 82.48,51.25 81.92,51.82 62.64,51.82 58.06,47.24 46.33,47.24 42.82,50.75 41.91,50.75 STEPFPGA.22 | v7.32,38.86 9.3,36.88 10.06,36.88 U$1.14 | v7.32,67.82 4.12,71.02 2.59,71.02 SPI.7
MSCK
  Top 0.152: U$3.17 21.49,29.26 20.73,30.02 16.92,30.02 16.15,29.26 10.21,29.26 U$1.17 10.06,29.26 10.06,30.63 8.69,32 8.69,43.43 10.06,44.81 22.4,44.81 23.01,45.41 23.01,64.62 U$4.17 20.73,66.9 16.92,66.9 16.15,66.14 10.21,66.14 U$2.17 8.69,67.51 8.69,71.32 9.3,71.93 10.21,71.93 13.11,74.83 22.55,74.83 27.89,69.49 27.89,68.73 28.96,67.67 29.26,67.67 33.68,63.25 33.68,54.56 41.91,46.33 STEPFPGA.24
  Bottom 0.152: STEPFPGA.24 42.06,45.57 43.43,45.57 44.5,44.5 58.37,44.5 61.57,47.7 73.03,47.7 74.98,49.66 SDMMC.5 | SPI.5 2.59,65.99 3.66,65.99 4.42,65.23 8.53,65.23 9.3,65.99 10.06,65.99 U$2.17
N$1
  Top 0.152: U$1.26 10.06,6.4 10.06,7.32 7.92,9.45 7.92,49.99 7.32,50.6 7.32,66.9 8.38,67.97 8.38,71.93 10.06,73.61 U$2.14
N$2
  Top 0.152: U$3.14 21.49,36.88 18.9,36.88 12.65,43.13 10.21,43.13 U$2.26
N$3
  Top 0.152: U$4.14 23.62,71.63 23.62,36.58 23.32,36.27 23.32,8.84 21.64,7.16 21.64,6.4 U$3.26
N$4
  Bottom 0.152: C2.2 38.42,55.88 46.99,55.88 IC4.3
N$5
  Bottom 0.152: C2.1 R4.2 R5.2
N$6
  Bottom 0.152: TV-OUT.1 R2.1 R1.1
N$7
  Top 0.152: IC4.5 53.34,62.23 C24.A
  Bottom 0.152: C3.1 51.65,64.77 IC4.5
N$8
  Bottom 0.152: C3.2 R6.2
N$9
  Bottom 0.152: C11.1 IC4.1
N$10
  Bottom 0.152: C11.2 IC4.8
N$11
  Top 0.152: C24.C SPK.1
N$12
  Bottom 0.152: C13.2 IC4.7
N$23
  Bottom 0.152: R7.1 34.29,67.33 PS/2.5
N$24
  Bottom 0.152: R8.1 36.83,67.31 38.1,68.58 38.1,71.48 PS/2.1
NMI
  Top 0.152: IC2.11 87.63,44.5 89.31,44.5 94.64,39.17 96.72,39.17 EXT.4
NSS0  (via drill 0.35)
  Top 0.152: U$2.18 10.21,63.55 13.11,63.55 13.87,64.31 20.73,64.31 21.49,63.55 U$4.18 | U$1.18 13.11,26.67 14.02,27.58 20.57,27.58 21.49,26.67 U$3.18 | STEPFPGA.25 41.91,42.67 40.23,41 40.23,32.77 41.6,31.39 42.98,31.39 43.59,30.79 43.59,27.58 42.98,26.98 33.22,26.98 30.18,30.02 25.91,30.02 | v23.93,28.04 25.91,30.02 | v24.23,62.03 24.23,57.3 23.93,57 23.93,32 25.91,30.02
  Bottom 0.152: v23.93,28.04 22.55,26.67 U$3.18 | v24.23,62.03 23.16,63.09 23.01,62.94 22.55,63.4 21.64,63.4 U$4.18
NSS1  (via drill 0.35)
  Top 0.152: v83.59,50.44 61.72,50.44 58.22,46.94 49.07,46.94 42.82,40.69 41.91,40.69 STEPFPGA.26
  Bottom 0.152: SDMMC.1 84.96,50.44 v83.59,50.44
NSS2  (via drill 0.35)
  Top 0.152: STEPFPGA.31 41.91,28.5 27.28,43.13 27.28,53.95 v24.54,56.69
  Bottom 0.152: v24.54,56.69 24.08,57.15 16.31,57.15 11.28,62.18 4.88,62.18 3.66,63.4 2.59,63.4 SPI.4
OSC
  Top 0.152: U$3.25 20.73,9.75 13.87,9.75 13.11,8.99 10.21,8.99 U$1.25 10.06,8.99 10.06,9.75 8.38,11.43 8.38,44.04 10.06,45.72 U$2.25 13.11,45.72 14.02,46.63 20.57,46.63 21.49,45.72 U$4.25
P23  (via drill 0.35)
  Top 0.152: 3.81,43.18 GPIO.5 3.81,43.13 4.57,42.37 v4.57,16.31 | v6.1,14.78 4.12,12.8 2.59,12.8 UART.1
  Bottom 0.152: v4.57,16.31 v6.1,14.78
P24  (via drill 0.35)
  Top 0.152: 3.81,40.64 GPIO.6 | UART.2 7.32,14.94 v7.32,37.34
  Bottom 0.152: v7.32,37.34 4.12,40.54 2.59,40.54 GPIO.6
PS2CLK
  Bottom 0.152: 34.29,60.66 R7.2 | 34.29,60.66 32.61,60.66 30.79,58.83 30.79,58.06 30.94,57.91 30.94,48.01 32.77,46.18 32.77,41.76 41.45,33.07 41.91,33.07 STEPFPGA.29 | 34.29,60.66 R9.1
PS2DAT
  Bottom 0.152: R8.2 R10.1 36.88,60.5 37.49,60.5 37.95,60.05 37.95,57.61 33.07,52.73 33.07,44.5 41.91,35.66 STEPFPGA.28
PWM
  Bottom 0.152: R4.1 36.83,41.91 40.64,38.1 STEPFPGA.27
RES
  Top 0.152: EXT.3 91.59,38.1 85.24,44.45 IC2.12
ROMCS
  Bottom 0.152: EXT.10 97.69,30.48 96.32,31.85 94.61,31.85 94.31,32.16 74.68,32.16 70,36.83 IC2.3
RS
  Top 0.152: U$1.15 13.11,34.29 14.02,35.2 20.57,35.2 21.18,34.59 | 21.18,34.59 21.49,34.29 U$3.15 21.18,34.59 | 20.12,71.93 20.73,71.93 21.49,71.17 U$4.15 21.64,71.02 23.32,69.34 23.32,36.73 21.18,34.59 | 20.12,71.93 13.87,71.93 13.11,71.17 10.21,71.17 U$2.15 | STEPFPGA.30 30.02,42.37 30.02,43.74 27.58,46.18 27.58,69.34 22.4,74.52 20.73,74.52 20.12,73.91 20.12,71.93
RW
  Top 0.152: IC2.5 74.98,36.88 75.59,36.88 77.11,38.41 77.88,38.41 79.1,37.19 79.1,35.81 80.77,34.14 96.62,34.14 97.69,33.07 EXT.8
  Bottom 0.152: EXT.8 97.84,32.92 98.6,32.16 98.6,31.09 98.91,30.79 98.91,30.18 97.99,29.26 97.69,29.26 96.77,28.35 96.77,28.04 95.56,26.82 94.79,26.82 93.88,25.91 93.88,14.02 87.63,7.77 IC1.1
SEL
  Bottom 0.152: U$1.21 10.82,19.05 11.28,18.59 12.65,18.59 R3.1
TVOUT0
  Bottom 0.152: STEPFPGA.18 59.69,50.8 R1.2
TVOUT1
  Bottom 0.152: R2.2 54.61,61.38 54.61,52.07 55.88,50.8 STEPFPGA.19
VCC  (via drill 0.35)
  Top 0.813: IC3.20 IC3.1 | U$4.10 31.75,63.5 v31.75,58.42 31.75,50.8 U$4.3 | U$3.10 31.75,26.67 31.75,13.97 U$3.3 39.22,1.42 53.49,1.42 STEPFPGA.1
  Bottom 0.152: 63.32,6.17 64.31,5.18 65.08,5.18 C4.1 | C1.1 80.47,5.18 80.47,7.01 80.16,7.32 IC1.20 | C5.1 62.33,44.04 64.47,44.04 IC2.20
  Bottom 0.813: 62.23,5.08 STEPFPGA.1 C12.1 | 62.23,5.08 63.32,6.17 IC3.20 | IC3.1 IC1.20 | 62.23,5.08 60.96,6.35 60.96,33.02 IC2.1 IC2.20 64.77,45.72 66.04,46.99 75.56,46.99 | 75.56,46.99 C10.1 | U$4.10 23.72,66.04 22.61,64.93 20.57,64.93 19.46,66.04 U$2.10 | 24.13,53.34 U$4.3 31.75,45.72 31.75,31.75 U$3.10 23.72,29.21 22.61,28.1 20.57,28.1 19.46,29.21 U$1.10 | 24.13,53.34 U$4.22 20.32,53.34 19.05,52.07 13.97,52.07 | U$2.3 13.97,52.07 | 13.97,52.07 12.7,53.34 | 12.7,53.34 U$2.22 9.53,53.34 4.45,58.42 SPI.2 | U$3.3 24.13,16.51 | 24.13,16.51 U$3.22 20.32,15.24 15.24,15.24 | U$1.3 13.97,15.24 | 13.97,15.24 12.7,16.51 | 12.7,16.51 U$1.22 | 15.24,15.24 13.97,15.24 | R10.2 R9.2 32.17,58.84 v31.75,58.42 | R3.2 12.7,16.51 | C6.1 15.24,15.24 | C7.1 24.13,16.51 | C8.1 12.7,53.34 | C9.1 24.13,53.34 | SDMMC.4 77.48,48.91 75.56,46.99

### Text on the board
Top: PYLDIN-2018 / EXT-MOD v1.2 / z.pdaXrom.org
tPlace: GND | MOSI | MISO | MSCK | NSS2 | SD | RES | +3.3V | +5V | GND | P20 | FPGA | P21 | P22 | P23RX | CTRL | P24TX | P25 | P26 | P27 | P52 | P53 | P54 | P55 | ADDR | DATA | P56 | P57 | +5V | RX | TX | GND